# Altium project openmv-ae3-r3.PrjPcb (part 1 of 2)
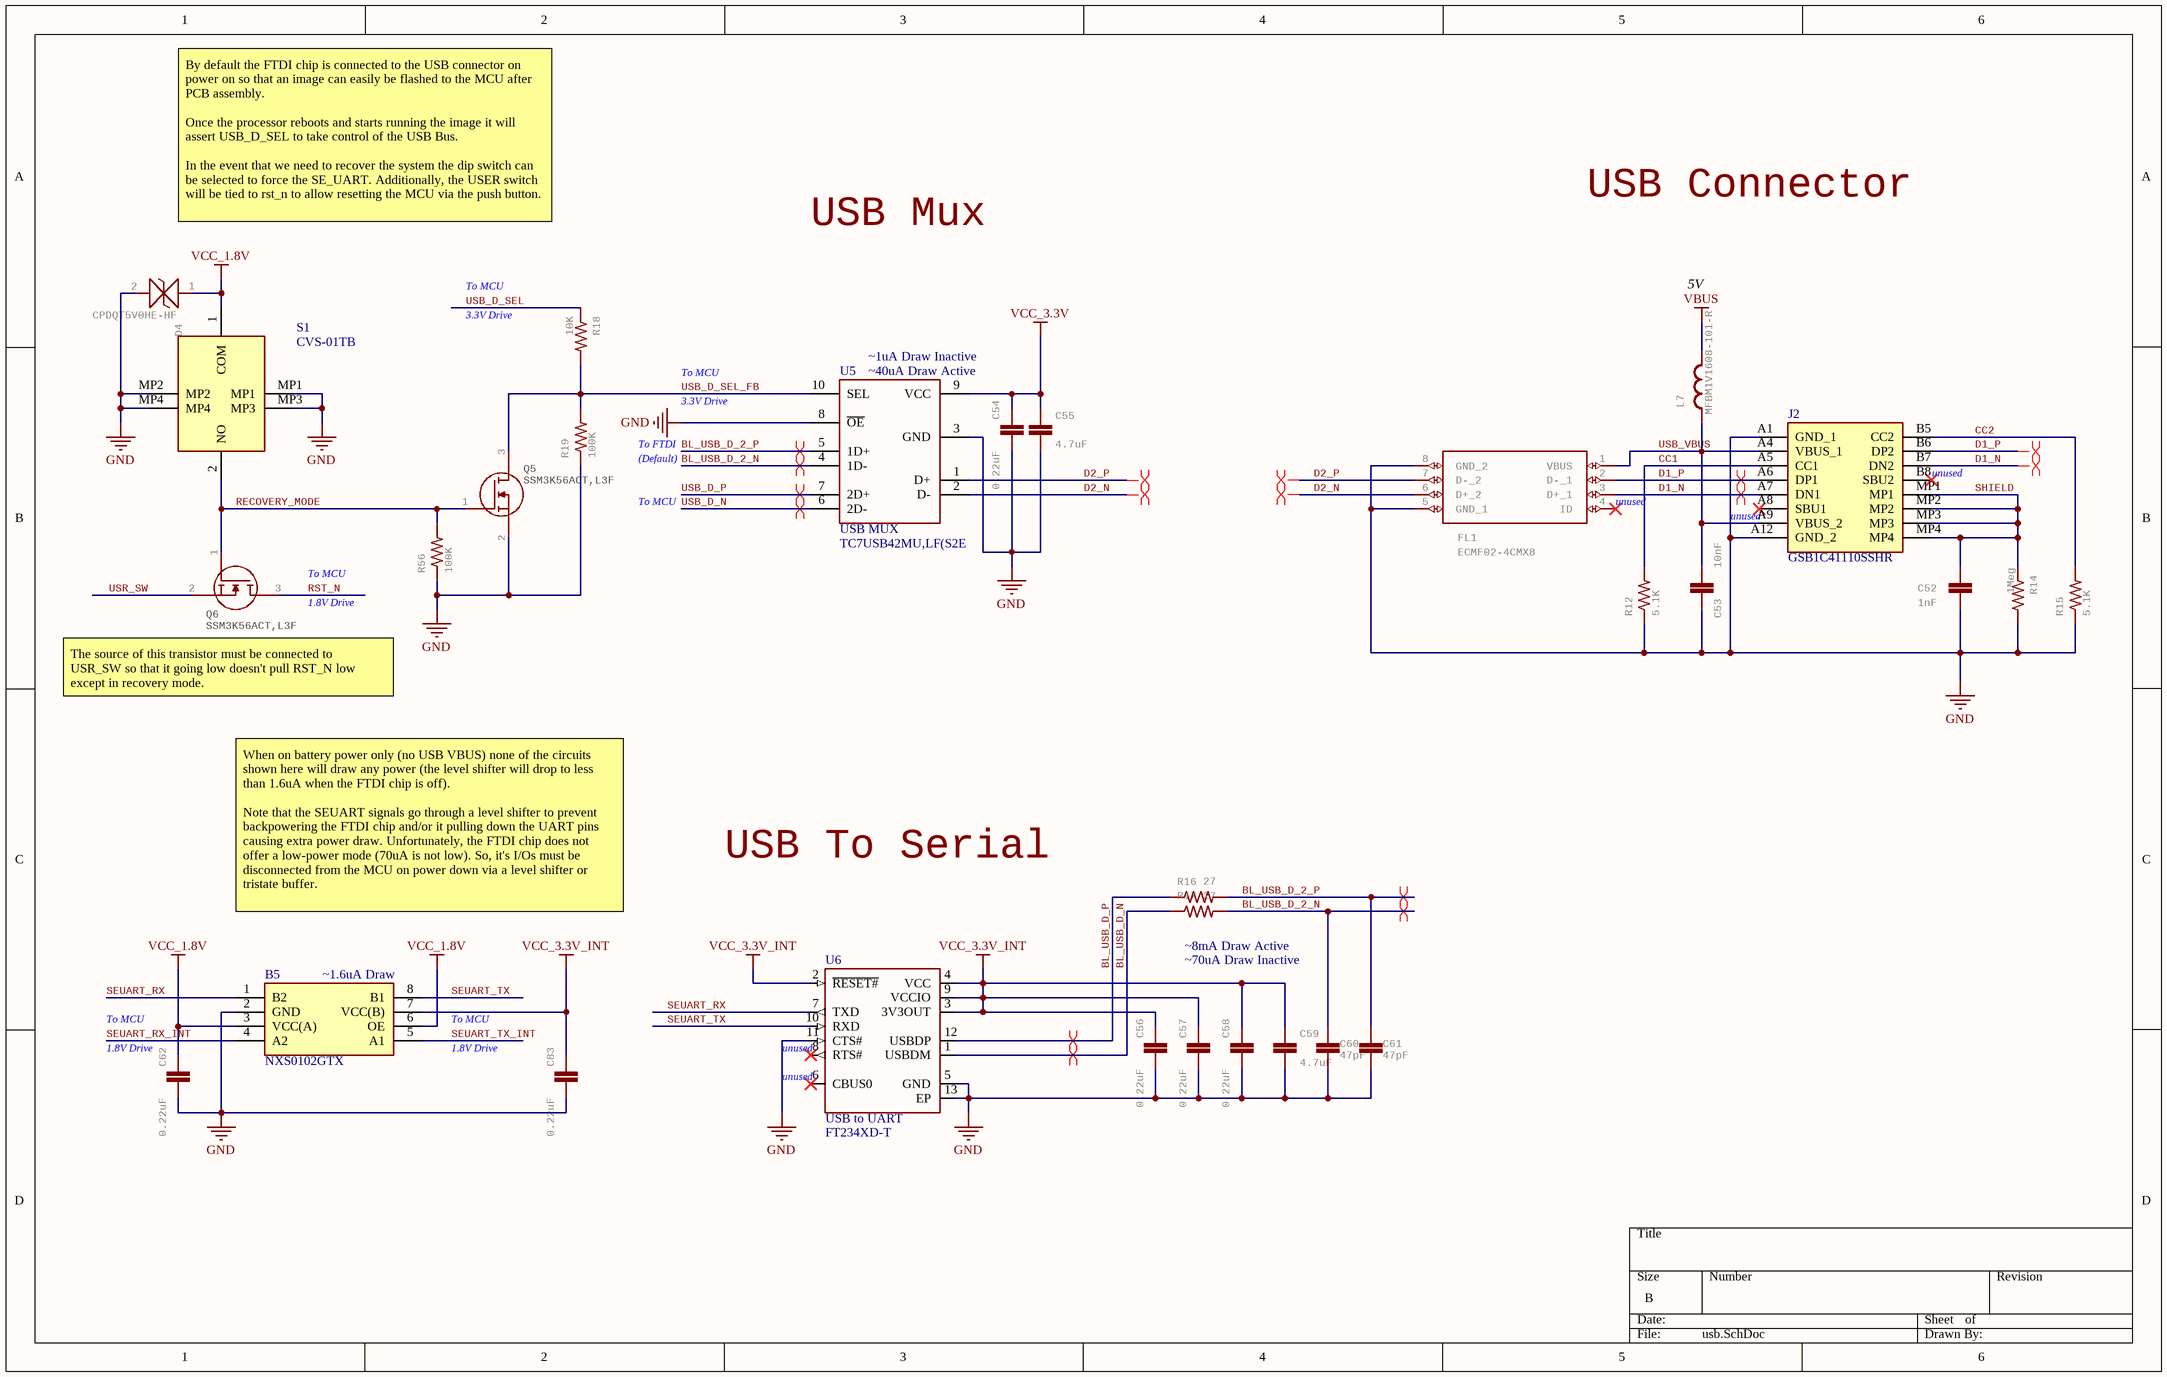
[diagram p0: usb.SchDoc]
10 sheets, 246 parts. Net scope: global (net labels, ports and power ports of the same name join across sheets).
Board file: openmv-ae3.PcbDoc
Sheets:
  usb.SchDoc
  wifi-bt.SchDoc
  flash.SchDoc
  imu.SchDoc
  camera.SchDoc
  tof.SchDoc
  mic.SchDoc
  regulators.SchDoc
  b2b.SchDoc
  processor.SchDoc

## Sheet usb.SchDoc
size B

### Parts
B5  NXS0102GTX  [NXS0102GTX]
C52  1nF  [0402-CAP]
C53  10nF  [0402-CAP]
C54  0.22uF  [C0201]
C55  4.7uF  [0402-CAP]
C56  0.22uF  [C0201]
C57  0.22uF  [C0201]
C58  0.22uF  [C0201]
C59  4.7uF  [0402-CAP]
C60  47pF  [C0201]
C61  47pF  [C0201]
C62  0.22uF  [C0201]
C83  0.22uF  [C0201]
D4  CPDQT5V0HE-HF  [CPDQT5V0HEHF]
FL1  ECMF02-4CMX8  [ECMF024CMX8]
J2  GSB1C41110SSHR  [GSB1C41110SSHR]
L7  MFBM1V1608-101-R  [0603-RES]
Q5  MPN: SSM3K56ACT,L3F  [DFN1006]  (hidden comment: NMOS)
Q6  MPN: SSM3K56ACT,L3F  [DFN1006]  (hidden comment: NMOS)
R12  5.1K  [R0201]
R14  1Meg  [0402-RES]
R15  5.1K  [R0201]
R16  27  [R0201]
R17  27  [R0201]
R18  10K  [R0201]
R19  100K  [R0201]
R56  100K  [R0201]
S1  CVS-01TB  [CVS01TB]
U5  USB MUX  [TC7USB42MU,LF(S2E]
U6  USB to UART  [SON45P300X300X80-13N]

### Nets
GND: B5.2(GND) C52.2 C53.1 C54.2 C55.1 C56.2 C57.2 C58.2 C59.1 C60.1 C61.1 C62.2 C83.2 D4.2 FL1.5(GND_1) FL1.8(GND_2) J2.A1(GND_1) J2.A12(GND_2) Q5.2(S) R12.1 R14.2 R15.1 R19.1 R56.1 S1.MP1 S1.MP2 S1.MP3 S1.MP4 U5.3(GND) U5.8(~{OE}) U6.5(GND) U6.11(CTS#) U6.13(EP)
VBUS: L7.2
VCC_1.8V: B5.3(VCC(A)) B5.6(OE) C62.1 D4.1 S1.1(COM)
VCC_3.3V: C54.1 C55.2 U5.9(VCC)
VCC_3.3V_INT: B5.7(VCC(B)) C56.1 C57.1 C58.1 C59.2 C83.1 U6.2(~{RESET#}) U6.3(3V3OUT) U6.4(VCC) U6.9(VCCIO)
BL_USB_D_2_N: C60.2 R17.2 U5.4(1D-)
BL_USB_D_2_P: C61.2 R16.2 U5.5(1D+)
BL_USB_D_N: R17.1 U6.1(USBDM)
BL_USB_D_P: R16.1 U6.12(USBDP)
CC1: J2.A5(CC1) R12.2
CC2: J2.B5(CC2) R15.2
D1_N: FL1.3(D+_1) J2.A7(DN1) J2.B7(DN2)
D1_P: FL1.2(D-_1) J2.A6(DP1) J2.B6(DP2)
D2_N: FL1.6(D+_2) U5.2(D-)
D2_P: FL1.7(D-_2) U5.1(D+)
RECOVERY_MODE: Q5.1(G) Q6.1(G) R56.2 S1.2(NO)
RST_N: Q6.3(D)
SEUART_RX: B5.1(B2) U6.7(TXD)
SEUART_RX_INT: B5.4(A2)
SEUART_TX: B5.8(B1) U6.10(RXD)
SEUART_TX_INT: B5.5(A1)
SHIELD: C52.1 J2.MP1 J2.MP2 J2.MP3 J2.MP4 R14.1
USB_D_N: U5.6(2D-)
USB_D_P: U5.7(2D+)
USB_D_SEL: R18.1
USB_D_SEL_FB: Q5.3(D) R18.2 R19.2 U5.10(SEL)
USB_VBUS: C53.2 FL1.1(VBUS) J2.A4(VBUS_1) J2.A9(VBUS_2) L7.1
USR_SW: Q6.2(S)

Not connected (* = marked no-connect by the designer): FL1 4(ID)*; J2 A8(SBU1)* B8(SBU2)*; U6 6(CBUS0)* 8(RTS#)*

### Layout directives
differential pair: BL_USB_D_2_N, BL_USB_D_2_P, BL_USB_D_N, BL_USB_D_P, D1_N, D1_P, D2_N, D2_P, USB_D_N, USB_D_P

### Notes on the sheet
- By default the FTDI chip is connected to the USB connector on power on so that an image can easily be flashed to the MCU after PCB assembly.
  Once the processor reboots and starts running the image it will assert USB_D_SEL to take control of the USB Bus.
  In the event that we need to recover the system the dip switch can be selected to force the SE_UART. Additionally, the USER switch will be tied to rst_n to allow resetting the MCU via the push button.
- USB Mux
- USB Connector
- To MCU
- 3.3V Drive
- 5V
- (near U5) ~1uA Draw Inactive
- (near U5) ~40uA Draw Active
- To FTDI
- (Default)
- (near FL1) unused
- (near J2) unused
- (near Q6) To MCU
- (near Q6) 1.8V Drive
- (near Q6) The source of this transistor must be connected to USR_SW so that it going low doesn't pull RST_N low except in recovery mode.
- USB To Serial
- When on battery power only (no USB VBUS) none of the circuits shown here will draw any power (the level shifter will drop to less than 1.6uA when the FTDI chip is off).
  Note that the SEUART signals go through a level shifter to prevent backpowering the FTDI chip and/or it pulling down the UART pins causing extra power draw. Unfortunately, the FTDI chip does not offer a low-power mode (70uA is not low). So, it's I/Os must be disconnected from the MCU on power down via a level shifter or tristate buffer.
- ~70uA Draw Inactive
- ~8mA Draw Active
- (near B5) ~1.6uA Draw
- (near C62) 1.8V Drive
- 1.8V Drive
- (near U6) unused

### Library data of the parts
B5 = NXS0102GTX: Dual supply translating transceiver; open drain; auto direction sensing; Manufacturer_Name: Nexperia; Geometry.Height: 0.5mm; Mouser Part Number: 771-NXS0102GTX; Mouser Price/Stock: https://www.mouser.co.uk/ProductDetail/Nexperia/NXS0102GTX?qs=GBLSl2AkirukzzJX55VgJA%3D%3D; Manufacturer_Part_Number: NXS0102GTX; Datasheet Link: https://assets.nexperia.com/documents/data-sheet/NXS0102.pdf; MPN: NXS0102GTX; Part Number: NXS0102GTX
C52 = CAP0402-CAP: Capacitor; MPN: VJ0402Y102JXACW1BC; GateName_1: G$1; SymbolName_1: CAP; DeviceName: 0402-CAP; LibraryName: sfe; DeviceSetName: CAP; Part Number: VJ0402Y102JXACW1BC
C53 = C-EUC0201: CAPACITOR, European symbol; MPN: 0402B103K250CT; GateName_1: G$1; SymbolName_1: C-EU; POPULARITY: 0; LibraryName: rcl; DeviceSetName: C-EU; SPICEPREFIX: C; Part Number: 0402B103K250CT
C54 C56-C58 C62 C83 = C-EUC0201: CAPACITOR, European symbol; MPN: GRM033R60J224ME15D; GateName_1: G$1; SymbolName_1: C-EU; POPULARITY: 0; DeviceName: C0201; LibraryName: rcl; DeviceSetName: C-EU; SPICEPREFIX: C; Part Number: GRM033R60J224ME15D
C55 C59 = CAP0402-CAP: CapacitorStandard 0603 ceramic capacitor, and 0.1" leaded capacitor.; MPN: JMK105BBJ475MV-F; GateName_1: G$1; SymbolName_1: CAP; DeviceName: 0402-CAP; LibraryName: sfe; DeviceSetName: CAP; Part Number: JMK105BBJ475MV-F
C60 C61 = C-EUC0201: CAPACITOR, European symbol; MPN: GRM0335C1H470GA01J; GateName_1: G$1; SymbolName_1: C-EU; POPULARITY: 0; DeviceName: C0201; SPICEPREFIX: C; Part Number: GRM0335C1H470GA01J
D4 = CPDQT5V0HE-HF: ESD Suppressors / TVS Diodes DIODE ESD 5VWM 65W 0402/SOD-923F   Source:  Datasheet; MANUFACTURER_NAME: Comchip Technology; GateName_1: G$1; SymbolName_1: CPDQT5V0HE-HF; LibraryName: CPDQT5V0HE-HF; DeviceSetName: CPDQT5V0HE-HF; HEIGHT: 0.42mm; MANUFACTURER_PART_NUMBER: CPDQT5V0HE-HF; MOUSER_PART_NUMBER: MOUSER_PART_NUMBER; MOUSER_PRICE-STOCK: MOUSER_PRICE-STOCK; MPN: CPDQT5V0HE-HF; Part Number: CPDQT5V0HE-HF
FL1 = ECMF02-4CMX8: Common Mode Filter & ESD Prot. USB uQFN8 STMicroelectronics ECMF02 Series, Signal Filter uQFN SMD, Flat Contact Termination, 2.6 x 1.3 x 0.6mm   Source:  Datasheet; GateName_1: G$1; SymbolName_1: ECMF02-4CMX8; LibraryName: ECMF02-4CMX8; DeviceSetName: ECMF02-4CMX8; HEIGHT: mm; MANUFACTURER_NAME: STMicroelectronics; MANUFACTURER_PART_NUMBER: ECMF02-4CMX8; MOUSER_PART_NUMBER: 511-ECMF02-4CMX8; MOUSER_PRICE-STOCK: https://www.mouser.co.uk/ProductDetail/STMicroelectronics/ECMF02-4CMX8?qs=xYt8xtm2zhmK7GoDlDZR3A%3D%3D; MPN: ECMF02-4CMX8; Part Number: ECMF02-4CMX8
J2 = GSB1C41110SSHR: Connector; Manufacturer_Name: Amphenol Communications Solutions; Datasheet Link: https://cdn.amphenol-cs.com/media/wysiwyg/files/drawing/gsb1c41x10sshr-ax1.pdf; Height: 3.41mm; Manufacturer_Part_Number: GSB1C41110SSHR; Part Number: GSB1C41110SSHR; MPN: GSB1C41110SSHR
L7 = INDUCTOR: InductorsBasic Inductor/Choke - 0603 and 1206. Footprints are not proven and vary greatly between part numbers.; GateName_1: G$1; MPN: MFBM1V1608-101-R; Part Number: MFBM1V1608-101-R
R12 R15 = RESISTOR0402-RES: ResistorBasic schematic elements and footprints for 0603, 1206, and PTH resistors.; MPN: AC0201FR-075K1L; GateName_1: G$1; SymbolName_1: RESISTOR; LibraryName: sfe; DeviceSetName: RESISTOR; Part Number: AC0201FR-075K1L
R14 = RESISTOR0402-RES: Resistor; MPN: CRCW04021M00FKEDC; GateName_1: G$1; SymbolName_1: RESISTOR; DeviceName: 0402-RES; LibraryName: sfe; DeviceSetName: RESISTOR; Part Number: CRCW04021M00FKEDC
R16 R17 = RESISTOR0402-RES: MPN: RC0201JR-0727RL; GateName_1: G$1; SymbolName_1: RESISTOR; LibraryName: sfe; DeviceSetName: RESISTOR; Part Number: RC0201JR-0727RL
R18 = RESISTOR0402-RES: MPN: RMCF0201FT10K0; GateName_1: G$1; SymbolName_1: RESISTOR; LibraryName: sfe; DeviceSetName: RESISTOR; Part Number: RMCF0201FT10K0
R19 R56 = RESISTOR0402-RES: MPN: RMCF0201FT100K; GateName_1: G$1; SymbolName_1: RESISTOR; LibraryName: sfe; DeviceSetName: RESISTOR; Part Number: RMCF0201FT100K
S1 = CVS-01TB: Switch; Manufacturer_Name: Nidec Copal; Datasheet Link: https://www.mouser.com/datasheet/2/972/cvs-1827291.pdf; Height: 1.45mm; Manufacturer_Part_Number: CVS-01TB; Mouser Part Number: 229-CVS-01TB; Mouser Price/Stock: https://www.mouser.co.uk/ProductDetail/Nidec-Components/CVS-01TB?qs=XeJtXLiO41SVso1ahlfkxQ%3D%3D; Arrow Part Number: CVS-01TB; Arrow Price/Stock: https://www.arrow.com/en/products/cvs-01tb/nidec-copal-electronics; Part Number: CVS-01TB; MPN: CVS-01TB
U5 = TC7USB42MU,LF(S2E: MF: Toshiba; MPN: TC7USB42MU,LF(S2E; Part Number: TC7USB42MU,LF(S2E
U6 = FT234XD-T: USB Bridge, USB to UART USB 2.0 UART Interface 12-DFN _3x3_; MF: FTDI,; Part Number: FT234XD-T; MPN: FT234XD-T
Q5 Q6 = NMOS: Part Number: SSM3K56ACT,L3F

## Sheet wifi-bt.SchDoc
size B
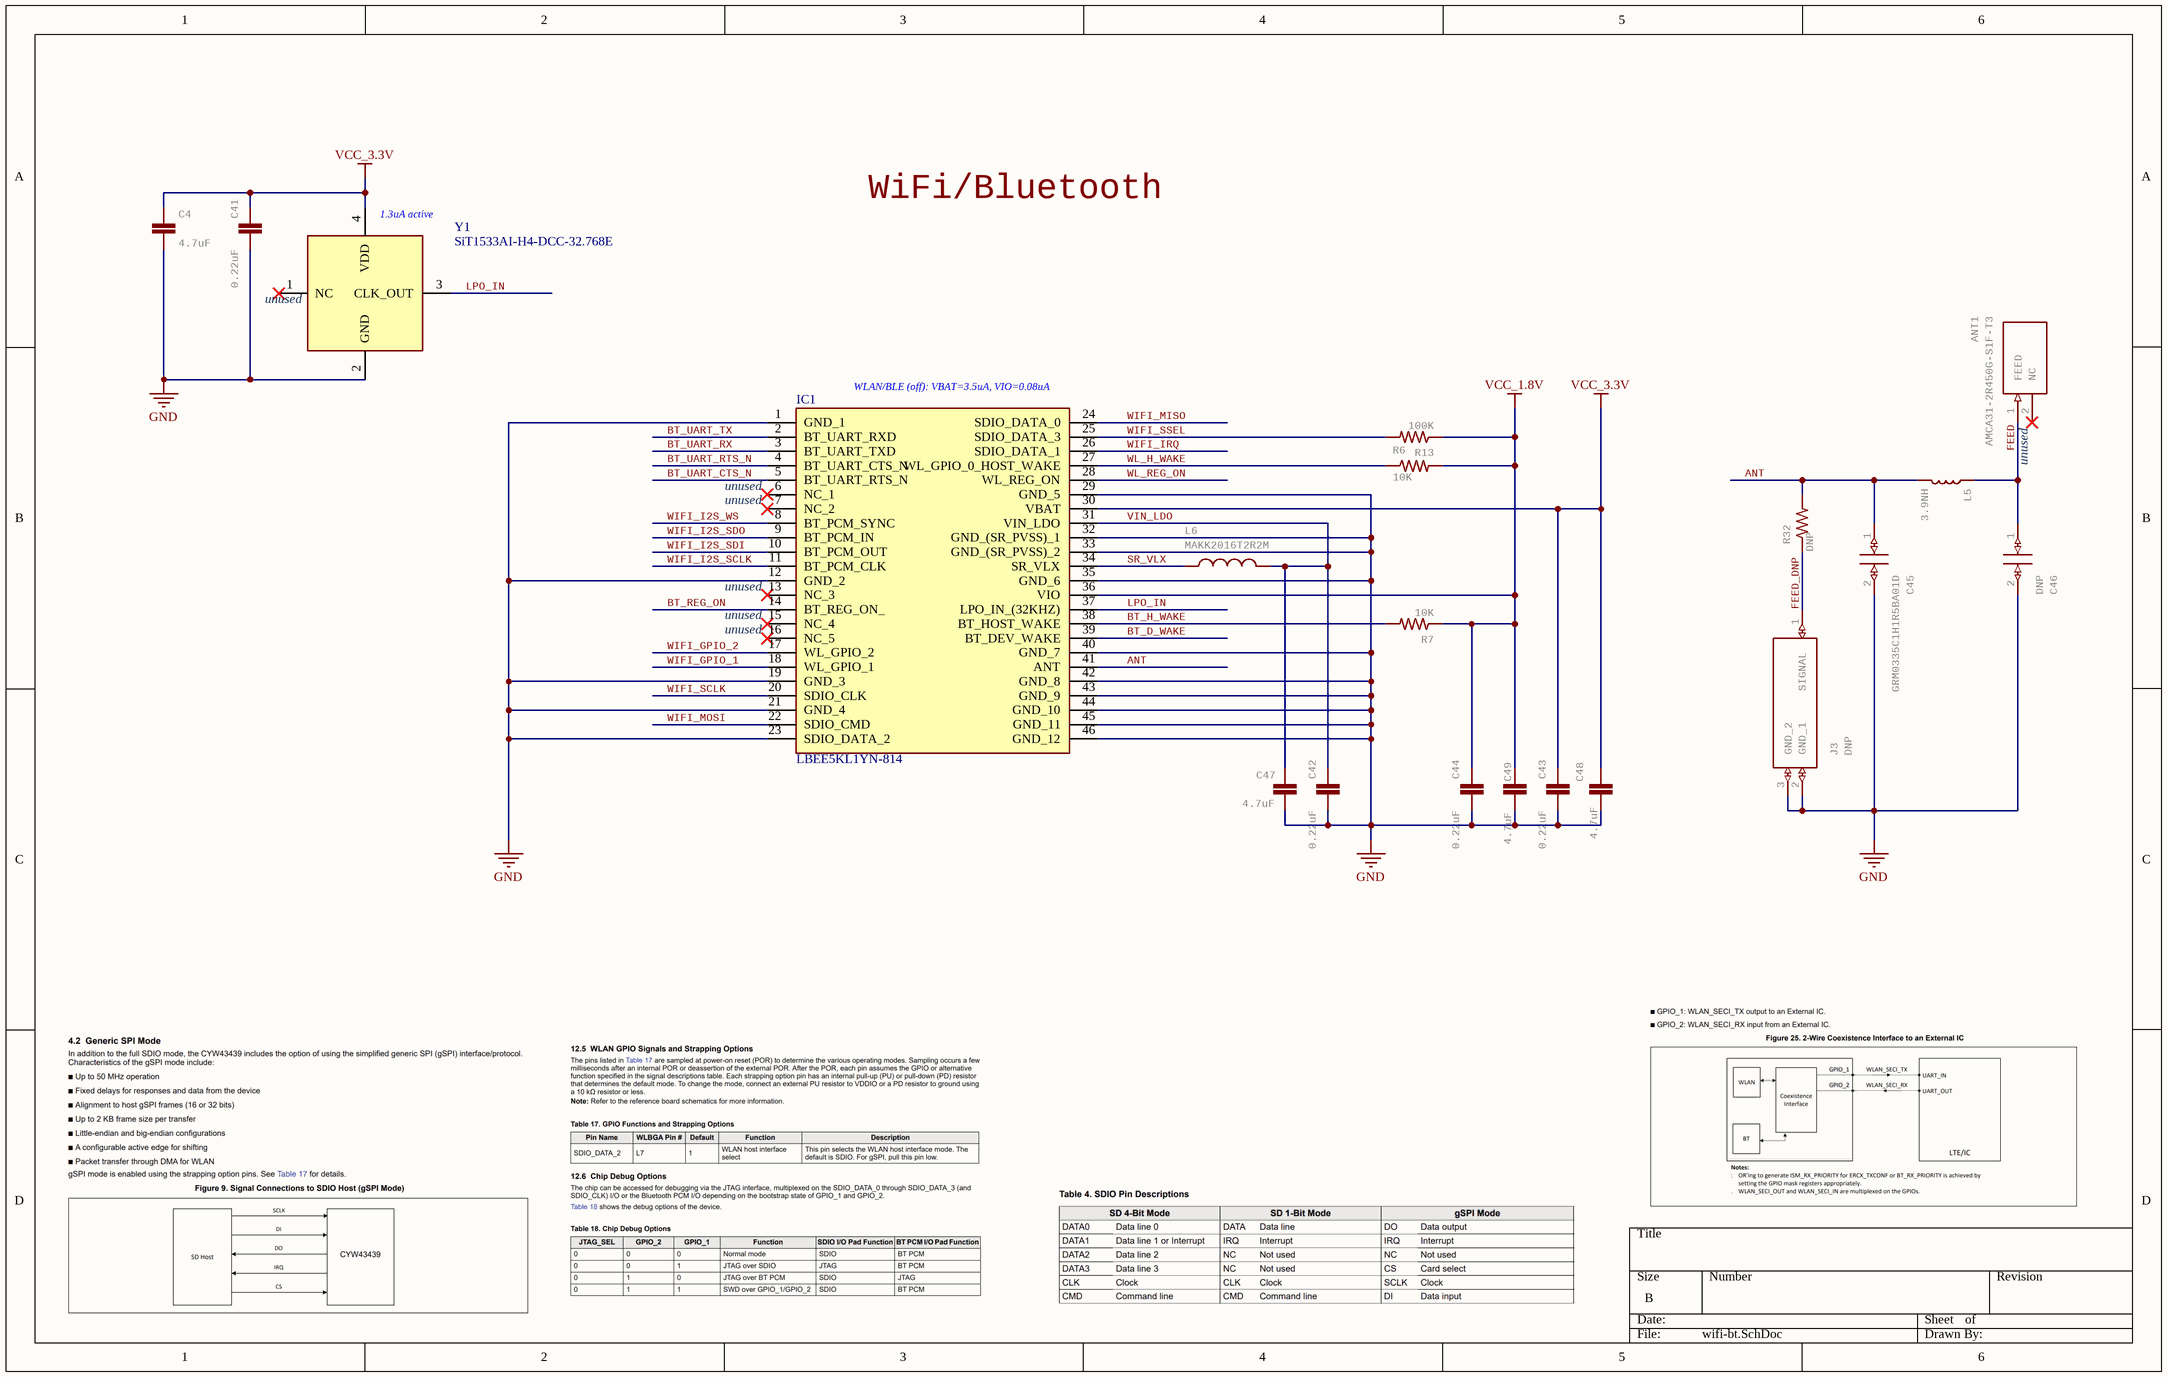
[diagram p1: wifi-bt.SchDoc]

### Parts
ANT1  AMCA31-2R450G-S1F-T3  [ANTC3216X140N]
C4  4.7uF  [0402-CAP]
C41  0.22uF  [C0201]
C42  0.22uF  [C0201]
C43  0.22uF  [C0201]
C44  0.22uF  [C0201]
C45  GRM0335C1H1R5BA01D  [CAPC0603X33N]
C46  DNP  [C0201-NO-3D]
C47  4.7uF  [0402-CAP]
C48  4.7uF  [0402-CAP]
C49  4.7uF  [0402-CAP]
IC1  LBEE5KL1YN-814  [LBEE5KL1YN814]
J3  DNP  [23370191-NO-3D]
L5  3.9NH  [0402]
L6  MAKK2016T2R2M  [INDC2016X100N]
R6  10K  [R0201]
R7  10K  [R0201]
R13  100K  [R0201]
R32  DNP  [0402-RES]
Y1  SiT1533AI-H4-DCC-32.768E  [SIT1533AIH4AA332768E]

### Nets
GND: C4.1 C41.2 C42.2 C43.2 C44.2 C45.2 C46.2 C47.1 C48.1 C49.1 IC1.1(GND_1) IC1.12(GND_2) IC1.19(GND_3) IC1.21(GND_4) IC1.23(SDIO_DATA_2) IC1.29(GND_5) IC1.32(GND_(SR_PVSS)_1) IC1.33(GND_(SR_PVSS)_2) IC1.35(GND_6) IC1.40(GND_7) IC1.42(GND_8) IC1.43(GND_9) IC1.44(GND_10) IC1.45(GND_11) IC1.46(GND_12) J3.2(GND_1) J3.3(GND_2) Y1.2(GND)
VCC_1.8V: C44.1 C49.2 IC1.36(VIO) R6.2 R7.1 R13.1
VCC_3.3V: C4.2 C41.1 C43.1 C48.2 IC1.30(VBAT) Y1.4(VDD)
ANT: C45.1 IC1.41(ANT) L5.2 R32.2
BT_D_WAKE: IC1.39(BT_DEV_WAKE)
BT_H_WAKE: IC1.38(BT_HOST_WAKE) R7.2
BT_REG_ON: IC1.14(BT_REG_ON_)
BT_UART_CTS_N: IC1.5(BT_UART_RTS_N)
BT_UART_RTS_N: IC1.4(BT_UART_CTS_N)
BT_UART_RX: IC1.3(BT_UART_TXD)
BT_UART_TX: IC1.2(BT_UART_RXD)
FEED: ANT1.1(FEED) C46.1 L5.1
FEED_DNP: J3.1(SIGNAL) R32.1
LPO_IN: IC1.37(LPO_IN_(32KHZ)) Y1.3(CLK_OUT)
SR_VLX: IC1.34(SR_VLX) L6.1
VIN_LDO: C42.1 C47.2 IC1.31(VIN_LDO) L6.2
WIFI_GPIO_1: IC1.18(WL_GPIO_1)
WIFI_GPIO_2: IC1.17(WL_GPIO_2)
WIFI_I2S_SCLK: IC1.11(BT_PCM_CLK)
WIFI_I2S_SDI: IC1.10(BT_PCM_OUT)
WIFI_I2S_SDO: IC1.9(BT_PCM_IN)
WIFI_I2S_WS: IC1.8(BT_PCM_SYNC)
WIFI_IRQ: IC1.26(SDIO_DATA_1)
WIFI_MISO: IC1.24(SDIO_DATA_0)
WIFI_MOSI: IC1.22(SDIO_CMD)
WIFI_SCLK: IC1.20(SDIO_CLK)
WIFI_SSEL: IC1.25(SDIO_DATA_3) R13.2
WL_H_WAKE: IC1.27(WL_GPIO_0_HOST_WAKE) R6.1
WL_REG_ON: IC1.28(WL_REG_ON)

Not connected (* = marked no-connect by the designer): ANT1 2(NC)*; IC1 6(NC_1)* 7(NC_2)* 13(NC_3)* 15(NC_4)* 16(NC_5)*; Y1 1(NC)*

### Notes on the sheet
- (near Y1) 1.3uA active
- WiFi/Bluetooth
- (near Y1) unused
- (near IC1) WLAN/BLE (off): VBAT=3.5uA, VIO=0.08uA
- (near ANT1) unused
- (near IC1) unused

### Library data of the parts
ANT1 = AMCA31-2R450G-S1F-T3: ABRACON - AMCA31-2R450G-S1F-T3 - ANTENNA, CHIP, 2.45GHZ, 50 OHM, 1206   Source:  Datasheet; GateName_1: G$1; SymbolName_1: AMCA31-2R450G-S1F-T3; LibraryName: AMCA31-2R450G-S1F-T3; DeviceSetName: AMCA31-2R450G-S1F-T3; HEIGHT: 1.4mm; MANUFACTURER_NAME: ABRACON; MANUFACTURER_PART_NUMBER: AMCA31-2R450G-S1F-T3; MOUSER_PART_NUMBER: 815-CA312R450GS1FT3; MOUSER_PRICE-STOCK: https://www.mouser.co.uk/ProductDetail/ABRACON/AMCA31-2R450G-S1F-T3?qs=AAveGqk956GLuOddQEK40Q%3D%3D; MPN: AMCA31-2R450G-S1F-T3; Part Number: AMCA31-2R450G-S1F-T3
C4 C47-C49 = CAP0402-CAP: as C55 on sheet usb; DeviceName: 0402-CAP; LibraryName: sfe; DeviceSetName: CAP; Part Number: JMK105BBJ475MV-F
C41-C44 = C-EUC0201: as C54 on sheet usb; DeviceName: C0201; LibraryName: rcl; DeviceSetName: C-EU; SPICEPREFIX: C; Part Number: GRM033R60J224ME15D
C45 = GRM0335C1H1R5BA01D: Chip Capacitor value 1R5   Source:  Datasheet; MANUFACTURER_NAME: Murata Electronics; GateName_1: G$1; SymbolName_1: GRM0335C1H1R5BA01D; LibraryName: GRM0335C1H1R5BA01D; DeviceSetName: GRM0335C1H1R5BA01D; HEIGHT: 0.33mm; MANUFACTURER_PART_NUMBER: GRM0335C1H1R5BA01D; MOUSER_PART_NUMBER: 81-GRM0335C1H1R5BA1D; MOUSER_PRICE-STOCK: https://www.mouser.co.uk/ProductDetail/Murata-Electronics/GRM0335C1H1R5BA01D?qs=7vGxPDjevFPFqveGwv%252BPUQ%3D%3D; MPN: GRM0335C1H1R5BA01D; Part Number: GRM0335C1H1R5BA01D
C46 = GRM0335C1H1R5BA01D: Chip Capacitor value 1R5   Source:  Datasheet; MANUFACTURER_NAME: Murata Electronics; GateName_1: G$1; POPULATE: 0; SymbolName_1: GRM0335C1H1R5BA01D; LibraryName: GRM0335C1H1R5BA01D; DeviceSetName: GRM0335C1H1R5BA01D; HEIGHT: 0.33mm; MANUFACTURER_PART_NUMBER: GRM0335C1H1R5BA01D; MOUSER_PART_NUMBER: 81-GRM0335C1H1R5BA1D; MOUSER_PRICE-STOCK: https://www.mouser.co.uk/ProductDetail/Murata-Electronics/GRM0335C1H1R5BA01D?qs=7vGxPDjevFPFqveGwv%252BPUQ%3D%3D; MPN: DNP; Part Number: DNP
IC1 = LBEE5KL1YN-814: Integrated Circuit; Manufacturer_Name: Murata Electronics; Datasheet Link: https://www.murata.com/products/productdata/8815814344734/type1yn.pdf; Height: 1.1mm; Manufacturer_Part_Number: LBEE5KL1YN-814; Mouser Part Number: 81-LBEE5KL1YN-814; Mouser Price/Stock: https://www.mouser.co.uk/ProductDetail/Murata-Electronics/LBEE5KL1YN-814?qs=TCDPyi3sCW1FrH0sh%252Bb5wA%3D%3D; Arrow Part Number: LBEE5KL1YN-814; Arrow Price/Stock: https://www.arrow.com/en/products/lbee5kl1yn-814/murata-manufacturing?region=nac; Part Number: LBEE5KL1YN-814; MPN: LBEE5KL1YN-814
J3 = 2337019-1: RF Connectors / Coaxial Connectors MicroCoax receptacle UMCC Gen 1   Source:  Datasheet; MANUFACTURER_NAME: TE Connectivity; GateName_1: G$1; POPULATE: 0; SymbolName_1: 2337019-1; LibraryName: 2337019-1; DeviceSetName: 2337019-1; HEIGHT: 1.4mm; MANUFACTURER_PART_NUMBER: 2337019-1; MOUSER_PART_NUMBER: 571-2337019-1; MOUSER_PRICE-STOCK: https://www.mouser.co.uk/ProductDetail/TE-Connectivity/2337019-1?qs=l4Gc20tDgJIuN7nS9rJkJw%3D%3D; MPN: DNP; Part Number: DNP
L5 = INDUCTOR-0402-3.9NH: Inductors    Resist changes in electrical current. Basically a coil of wire.   SparkFun Products:  SparkFun Load Cell Amplifier - HX711  IOIO-OTG - V2.2; MPN: L-07C3N9SV6T; GateName_1: G$1; PROD_ID: NDUC-13457; SymbolName_1: INDUCTOR; DeviceName: -0402-3.9NH; LibraryName: SparkFun-Coils; DeviceSetName: INDUCTOR; Part Number: L-07C3N9SV6T
L6 = MAKK2016T2R2M: INDUCTOR, METAL CORE Check availability; GateName_1: G$1; MF: Taiyo Yuden; SymbolName_1: MAKK2016T2R2M; LibraryName: MAKK2016T2R2M; DeviceSetName: MAKK2016T2R2M; AVAILABILITY: In Stock; MP: MAKK2016T2R2M; MPN: MAKK2016T2R2M; PACKAGE: 2016 Taiyo Yuden; PRICE: None; PURCHASE-URL: https://pricing.snapeda.com/search/part/MAKK2016T2R2M/?ref=eda; Part Number: MAKK2016T2R2M
R6 R7 = RESISTOR0402-RES: MPN: RMCF0201FT10K0; GateName_1: G$1; SymbolName_1: RESISTOR; LibraryName: sfe; DeviceSetName: RESISTOR; Part Number: RMCF0201FT10K0
R13 = RESISTOR0402-RES: MPN: RMCF0201FT100K; GateName_1: G$1; SymbolName_1: RESISTOR; LibraryName: sfe; DeviceSetName: RESISTOR; Part Number: RMCF0201FT100K
R32 = RESISTOR0402-RES: Resistor; GateName_1: G$1; SymbolName_1: RESISTOR; DeviceName: 0402-RES; LibraryName: sfe; DeviceSetName: RESISTOR; MPN: DNP; Part Number: DNP
Y1 = SIT1533AI-H4-AA3-32.768E: Crystal or Oscillator; Manufacturer_Name: SiTime; Datasheet Link: https://www.mouser.com/datasheet/2/371/SiT1533_datasheet-1324419.pdf; Height: 0.6mm; Manufacturer_Part_Number: SiT1533AI-H4-DCC-32.768E; Mouser Part Number: 788-1533AIH4DCC32.76; Mouser Price/Stock: https://www.mouser.com/ProductDetail/SiTime/SiT1533AI-H4-DCC-32.768E?qs=5SDzjInHUKoUZz9ePr9JwA%3D%3D; Arrow Part Number: SiT1533AI-H4-DCC-32.768E; MPN: SiT1533AI-H4-DCC-32.768E; Part Number: SiT1533AI-H4-DCC-32.768E

## Sheet flash.SchDoc
size A
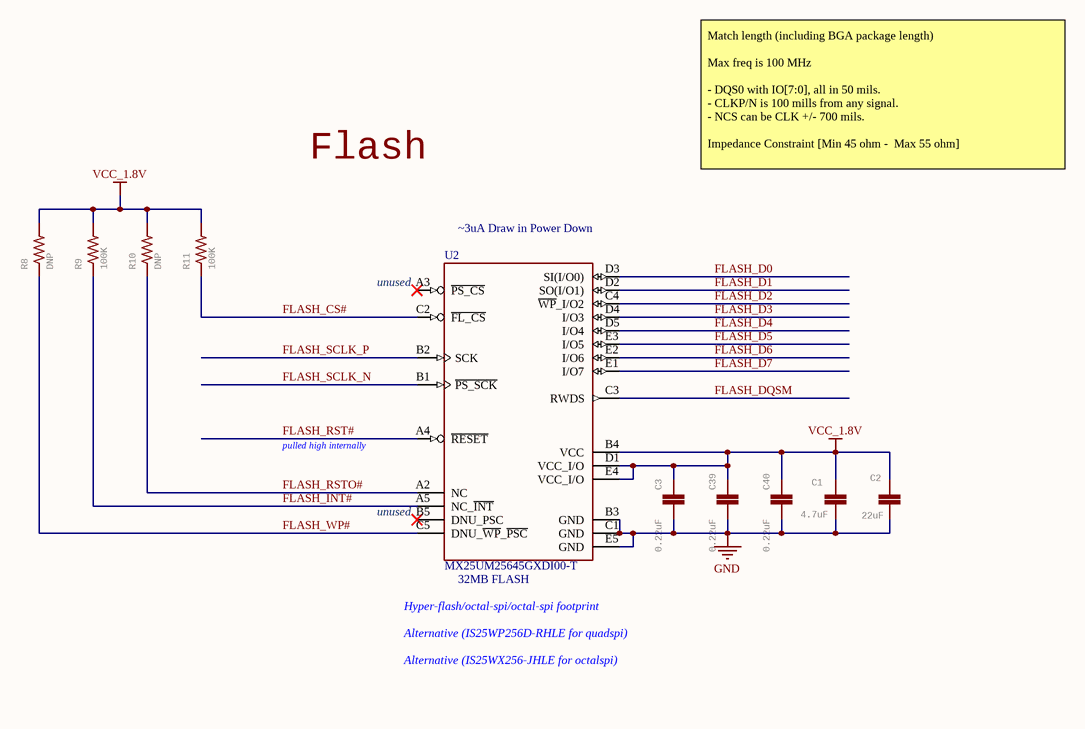
[diagram p2: flash.SchDoc]

### Parts
C1  4.7uF  [0402-CAP]
C2  22uF  [0805]
C3  0.22uF  [C0201]
C39  0.22uF  [C0201]
C40  0.22uF  [C0201]
R8  DNP  [R0201]
R9  100K  [R0201]
R10  DNP  [R0201]
R11  100K  [R0201]
U2  MX25UM25645GXDI00-T  [24-TBGA]

### Nets
GND: C1.1 C2.1 C3.2 C39.2 C40.2 U2.B3(GND) U2.C1(GND) U2.E5(GND)
VCC_1.8V: C1.2 C2.2 C3.1 C39.1 C40.1 R8.2 R9.2 R10.2 R11.2 U2.B4(VCC) U2.D1(VCC_I/O) U2.E4(VCC_I/O)
FLASH_CS#: R11.1 U2.C2(~{FL_CS})
FLASH_D0: U2.D3(SI(I/O0))
FLASH_D1: U2.D2(SO(I/O1))
FLASH_D2: U2.C4(~{WP}_I/O2)
FLASH_D3: U2.D4(I/O3)
FLASH_D4: U2.D5(I/O4)
FLASH_D5: U2.E3(I/O5)
FLASH_D6: U2.E2(I/O6)
FLASH_D7: U2.E1(I/O7)
FLASH_DQSM: U2.C3(RWDS)
FLASH_INT#: R9.1 U2.A5(NC_~{INT})
FLASH_RST#: U2.A4(~{RESET})
FLASH_RSTO#: R10.1 U2.A2(NC)
FLASH_SCLK_N: U2.B1(~{PS_SCK})
FLASH_SCLK_P: U2.B2(SCK)
FLASH_WP#: R8.1 U2.C5(DNU_~{WP}_~{PSC})

Not connected (* = marked no-connect by the designer): U2 A3(~{PS_CS})* B5(DNU_PSC)*

### Notes on the sheet
- Flash
- Match length (including BGA package length)
  Max freq is 100 MHz
  - DQS0 with IO[7:0], all in 50 mils.
  - CLKP/N is 100 mills from any signal.
  - NCS can be CLK +/- 700 mils.
  Impedance Constraint [Min 45 ohm -  Max 55 ohm]
- (near U2) ~3uA Draw in Power Down
- (near U2) unused
- pulled high internally
- Hyper-flash/octal-spi/octal-spi footprint
- (near U2) 32MB FLASH
- Alternative (IS25WP256D-RHLE for quadspi)
- Alternative (IS25WX256-JHLE for octalspi)

### Library data of the parts
C1 = CAP0402-CAP: as C55 on sheet usb; DeviceName: 0402-CAP; LibraryName: sfe; DeviceSetName: CAP; Part Number: JMK105BBJ475MV-F
C2 = 22UF-0805-6.3V-20%: 22ÂµF ceramic capacitors    A capacitor is a passive two-terminal electrical component used to store electrical energy temporarily in an electric field.; MPN: CL21A226MQQNNNE; GateName_1: G$1; SymbolName_1: CAP; PROD_ID: CAP-08402; DeviceName: -0805-6.3V-20%; LibraryName: SparkFun-Capacitors; DeviceSetName: 22UF; Part Number: CL21A226MQQNNNE
C3 C39 C40 = C-EUC0201: as C54 on sheet usb; DeviceName: C0201; LibraryName: rcl; DeviceSetName: C-EU; SPICEPREFIX: C; Part Number: GRM033R60J224ME15D
R8 R10 = RESISTOR0402-RES: GateName_1: G$1; SymbolName_1: RESISTOR; LibraryName: sfe; DeviceSetName: RESISTOR; MPN: DNP; Part Number: DNP
R9 R11 = RESISTOR0402-RES: MPN: RMCF0201FT100K; GateName_1: G$1; SymbolName_1: RESISTOR; LibraryName: sfe; DeviceSetName: RESISTOR; Part Number: RMCF0201FT100K
U2 = IS25WX256-JHLE: IC, Flash,32MB x 8, Octal SPI, Ind Temp, 1.8V,24-BGA; MF: ISSI; Part Number: MX25UM25645GXDI00-T; MPN: MX25UM25645GXDI00-T

## Sheet imu.SchDoc
size A
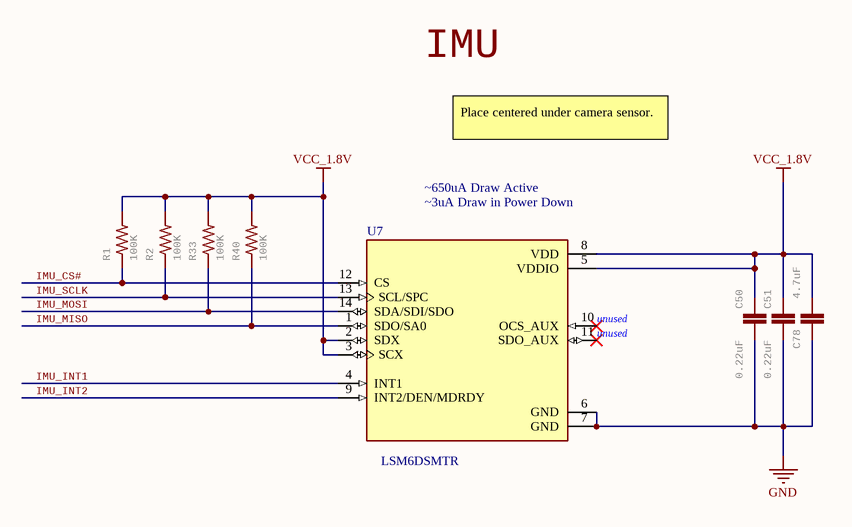
[diagram p3: imu.SchDoc]

### Parts
C50  0.22uF  [C0201]
C51  0.22uF  [C0201]
C78  4.7uF  [0402-CAP]
R1  100K  [R0201]
R2  100K  [R0201]
R33  100K  [R0201]
R40  100K  [R0201]
U7  (no value)  [LSM6DSMTR]

### Nets
GND: C50.2 C51.2 C78.1 U7.6(GND) U7.7(GND)
VCC_1.8V: C50.1 C51.1 C78.2 R1.2 R2.2 R33.2 R40.2 U7.2(SDX) U7.3(SCX) U7.5(VDDIO) U7.8(VDD)
IMU_CS#: R1.1 U7.12(CS)
IMU_INT1: U7.4(INT1)
IMU_INT2: U7.9(INT2/DEN/MDRDY)
IMU_MISO: R40.1 U7.1(SDO/SA0)
IMU_MOSI: R33.1 U7.14(SDA/SDI/SDO)
IMU_SCLK: R2.1 U7.13(SCL/SPC)

Not connected (* = marked no-connect by the designer): U7 10(OCS_AUX)* 11(SDO_AUX)*

### Notes on the sheet
- IMU
- ~650uA Draw Active
- Place centered under camera sensor.
- (near U7) ~3uA Draw in Power Down
- (near U7) unused

### Library data of the parts
C50 C51 = C-EUC0201: as C54 on sheet usb; DeviceName: C0201; LibraryName: rcl; DeviceSetName: C-EU; SPICEPREFIX: C; Part Number: GRM033R60J224ME15D
C78 = CAP_0402: 0402 (1005 Metric) Nick Garner - TeleSense; MPN: JMK105BBJ475MV-F; GateName_1: G$1; SymbolName_1: CAP; LibraryName: 0402; DeviceSetName: CAP_0402
R1 R2 R33 R40 = RESISTOR0402-RES: MPN: RMCF0201FT100K; GateName_1: G$1; SymbolName_1: RESISTOR; LibraryName: sfe; DeviceSetName: RESISTOR; Part Number: RMCF0201FT100K
U7 = LSM6DSMTR: Accelerometer, Gyroscope, Temperature, 6 Axis Sensor IÂ²C, SPI Output; MF: STMicroelectronics; Design Item ID: LSM6DSMTR; Package: VFLGA-14 STMicroelectronics; Component Type: Standard; Price: None; Value: *; Pin Count: 14; SnapEDA_Link: https://www.snapeda.com/parts/LSM6DSMTR/STMicroelectronics/view-part/581716/?ref=snap; Availability: Unavailable; Source: SnapEDAsch.SchLib; MP: LSM6DSMTR; MPN: LSM6DSMTR; Part Number: LSM6DSMTR

## Sheet camera.SchDoc
size A
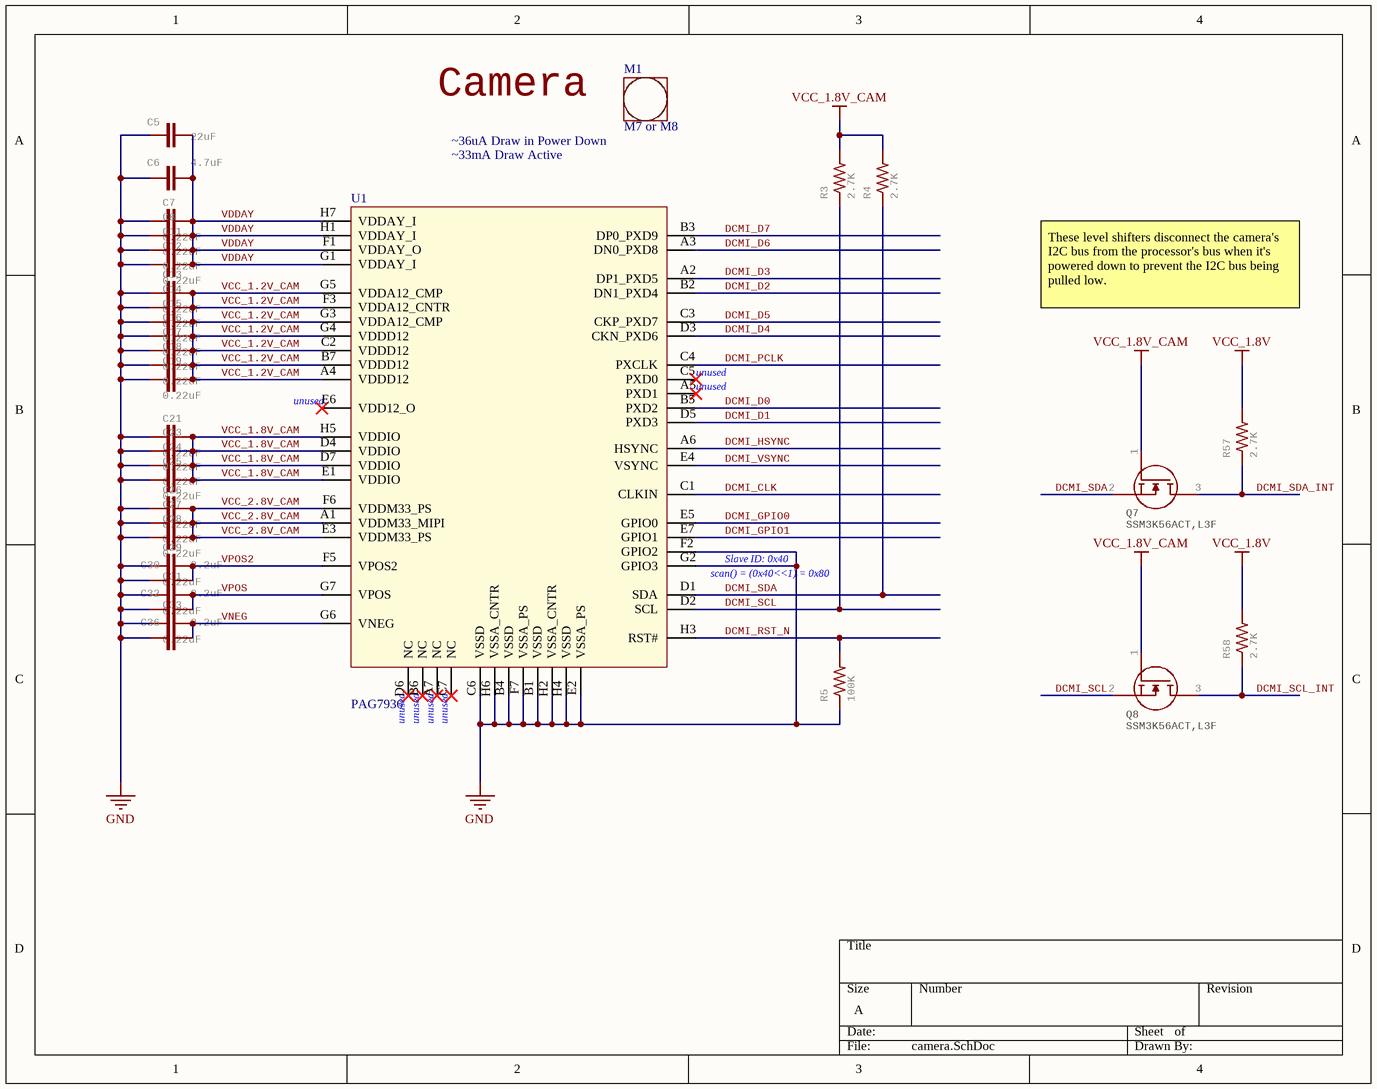
[diagram p4: camera.SchDoc]

### Parts
C5  22uF  [0805]
C6  4.7uF  [0402-CAP]
C7  0.22uF  [C0201]
C8  0.22uF  [C0201]
C11  0.22uF  [C0201]
C12  0.22uF  [C0201]
C13  0.22uF  [C0201]
C14  0.22uF  [C0201]
C15  0.22uF  [C0201]
C16  0.22uF  [C0201]
C17  0.22uF  [C0201]
C18  0.22uF  [C0201]
C19  0.22uF  [C0201]
C21  0.22uF  [C0201]
C23  0.22uF  [C0201]
C24  0.22uF  [C0201]
C25  0.22uF  [C0201]
C26  0.22uF  [C0201]
C27  0.22uF  [C0201]
C28  0.22uF  [C0201]
C29  0.22uF  [C0201]
C30  2.2uF  [0402-CAP]
C31  0.22uF  [C0201]
C32  2.2uF  [0402-CAP]
C33  0.22uF  [C0201]
C36  2.2uF  [0402-CAP]
M1  M7 or M8  [M7_M8]
Q7  MPN: SSM3K56ACT,L3F  [DFN1006]  (hidden comment: NMOS)
Q8  MPN: SSM3K56ACT,L3F  [DFN1006]  (hidden comment: NMOS)
R3  2.7K  [R0201]
R4  2.7K  [R0201]
R5  100K  [R0201]
R57  2.7K  [R0201]
R58  2.7K  [R0201]
U1  PAG7936  [PAG7936]

### Nets
GND: C5.1 C6.1 C7.1 C8.1 C11.1 C12.1 C13.1 C14.1 C15.1 C16.1 C17.1 C18.1 C19.1 C21.1 C23.1 C24.1 C25.1 C26.1 C27.1 C28.1 C29.1 C30.1 C31.1 C32.1 C33.1 C36.1 R5.1 U1.B1(VSSD) U1.B4(VSSD) U1.C6(VSSD) U1.E2(VSSA_PS) U1.F2(GPIO2) U1.F7(VSSA_PS) U1.G2(GPIO3) U1.H2(VSSA_CNTR) U1.H4(VSSD) U1.H6(VSSA_CNTR)
VCC_1.2V_CAM: C13.2 C14.2 C15.2 C16.2 C17.2 C18.2 C19.2 U1.A4(VDDD12) U1.B7(VDDD12) U1.C2(VDDD12) U1.F3(VDDA12_CNTR) U1.G3(VDDA12_CMP) U1.G4(VDDD12) U1.G5(VDDA12_CMP)
VCC_1.8V: R57.2 R58.2
VCC_1.8V_CAM: C21.2 C23.2 C24.2 C25.2 Q7.1(G) Q8.1(G) R3.2 R4.2 U1.D4(VDDIO) U1.D7(VDDIO) U1.E1(VDDIO) U1.H5(VDDIO)
VCC_2.8V_CAM: C26.2 C27.2 C28.2 U1.A1(VDDM33_MIPI) U1.E3(VDDM33_PS) U1.F6(VDDM33_PS)
DCMI_CLK: U1.C1(CLKIN)
DCMI_D0: U1.B5(PXD2)
DCMI_D1: U1.D5(PXD3)
DCMI_D2: U1.B2(DN1_PXD4)
DCMI_D3: U1.A2(DP1_PXD5)
DCMI_D4: U1.D3(CKN_PXD6)
DCMI_D5: U1.C3(CKP_PXD7)
DCMI_D6: U1.A3(DN0_PXD8)
DCMI_D7: U1.B3(DP0_PXD9)
DCMI_GPIO0: U1.E5(GPIO0)
DCMI_GPIO1: U1.E7(GPIO1)
DCMI_HSYNC: U1.A6(HSYNC)
DCMI_PCLK: U1.C4(PXCLK)
DCMI_RST_N: R5.2 U1.H3(RST#)
DCMI_SCL: Q8.2(S) R3.1 U1.D2(SCL)
DCMI_SCL_INT: Q8.3(D) R58.1
DCMI_SDA: Q7.2(S) R4.1 U1.D1(SDA)
DCMI_SDA_INT: Q7.3(D) R57.1
DCMI_VSYNC: U1.E4(VSYNC)
VDDAY: C5.2 C6.2 C7.2 C8.2 C11.2 C12.2 U1.F1(VDDAY_O) U1.G1(VDDAY_I) U1.H1(VDDAY_I) U1.H7(VDDAY_I)
VNEG: C33.2 C36.2 U1.G6(VNEG)
VPOS: C31.2 C32.2 U1.G7(VPOS)
VPOS2: C29.2 C30.2 U1.F5(VPOS2)

Not connected (* = marked no-connect by the designer): U1 A5(PXD1)* A7(NC)* B6(NC)* C5(PXD0)* C7(NC)* D6(NC)* E6(VDD12_O)*

### Notes on the sheet
- Camera
- (near M1) ~36uA Draw in Power Down
- ~33mA Draw Active
- These level shifters disconnect the camera's I2C bus from the processor's bus when it's powered down to prevent the I2C bus being pulled low.
- (near U1) unused
- (near U1) scan() = (0x40<<1) = 0x80
- Slave ID: 0x40

### Library data of the parts
C5 = 22UF-0805-6.3V-20%: as C2 on sheet flash; DeviceName: -0805-6.3V-20%; LibraryName: SparkFun-Capacitors; DeviceSetName: 22UF
C6 = CAP_0402: as C78 on sheet imu; LibraryName: 0402; DeviceSetName: CAP_0402
C7 C8 C11-C19 C21 C23-C29 C31 C33 = C-EUC0201: as C54 on sheet usb; DeviceName: C0201; LibraryName: rcl; DeviceSetName: C-EU; SPICEPREFIX: C; Part Number: GRM033R60J224ME15D
C30 C32 C36 = CAP_0402: 0402 (1005 Metric) Nick Garner - TeleSense; MPN: CL05A225MQ5NNNC; GateName_1: G$1; SymbolName_1: CAP; LibraryName: 0402; DeviceSetName: CAP_0402
M1 = M7_M8_LENS_MOUNT
R3 R4 R57 R58 = RESISTOR0402-RES: MPN: RC0201JR-072K7L; GateName_1: G$1; SymbolName_1: RESISTOR; LibraryName: sfe; DeviceSetName: RESISTOR; Part Number: RC0201JR-072K7L
R5 = RESISTOR0402-RES: MPN: RMCF0201FT100K; GateName_1: G$1; SymbolName_1: RESISTOR; LibraryName: sfe; DeviceSetName: RESISTOR; Part Number: RMCF0201FT100K
U1 = PAG7936: MF: PixArt; MPN: PAG7936
Q7 Q8 = NMOS: Part Number: SSM3K56ACT,L3F

## Sheet tof.SchDoc
size A
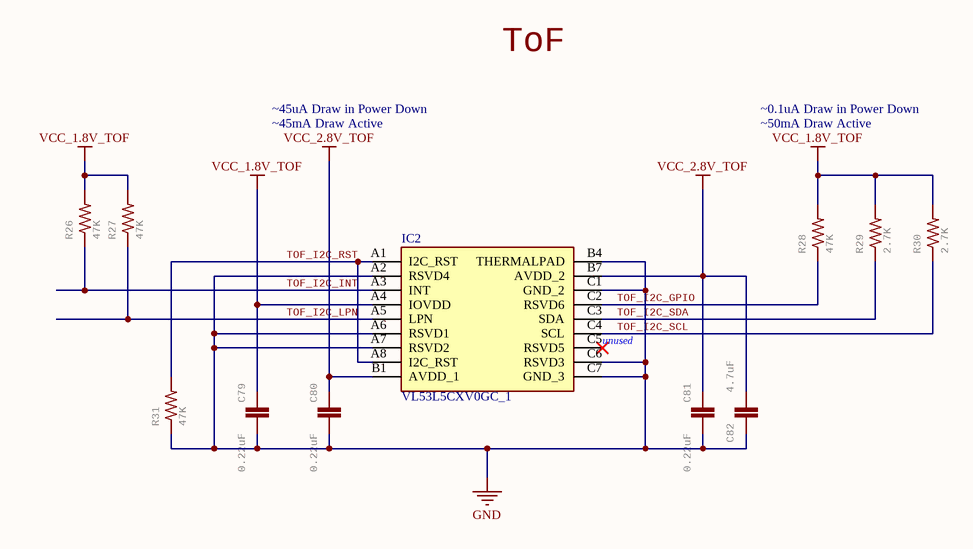
[diagram p5: tof.SchDoc]

### Parts
C79  0.22uF  [C0201]
C80  0.22uF  [C0201]
C81  0.22uF  [C0201]
C82  4.7uF  [0402-CAP]
IC2  VL53L5CXV0GC_1  [VL53L5CXV0GC1]
R26  47K  [R0201]
R27  47K  [R0201]
R28  47K  [R0201]
R29  2.7K  [R0201]
R30  2.7K  [R0201]
R31  47K  [R0201]

### Nets
GND: C79.2 C80.2 C81.2 C82.1 IC2.A2(RSVD4) IC2.A6(RSVD1) IC2.A7(RSVD2) IC2.B4(THERMALPAD) IC2.C1(GND_2) IC2.C6(RSVD3) IC2.C7(GND_3) R31.1
VCC_1.8V_TOF: C79.1 IC2.A4(IOVDD) R26.2 R27.2 R28.2 R29.2 R30.2
VCC_2.8V_TOF: C80.1 C81.1 C82.2 IC2.B1(AVDD_1) IC2.B7(AVDD_2)
TOF_I2C_GPIO: IC2.C2(RSVD6) R28.1
TOF_I2C_INT: IC2.A3(INT) R26.1
TOF_I2C_LPN: IC2.A5(LPN) R27.1
TOF_I2C_RST: IC2.A1(I2C_RST) IC2.A8(I2C_RST) R31.2
TOF_I2C_SCL: IC2.C4(SCL) R30.1
TOF_I2C_SDA: IC2.C3(SDA) R29.1

Not connected (* = marked no-connect by the designer): IC2 C5(RSVD5)*

### Notes on the sheet
- ~45uA Draw in Power Down
- ToF
- ~0.1uA Draw in Power Down
- ~45mA Draw Active
- ~50mA Draw Active
- (near IC2) unused

### Library data of the parts
C79-C81 = C-EUC0201: as C54 on sheet usb; DeviceName: C0201; LibraryName: rcl; DeviceSetName: C-EU; SPICEPREFIX: C; Part Number: GRM033R60J224ME15D
C82 = CAP_0402: as C78 on sheet imu; LibraryName: 0402; DeviceSetName: CAP_0402
IC2 = VL53L5CXV0GC_1: Integrated Circuit; Manufacturer_Name: STMicroelectronics; Manufacturer_Part_Number: VL53L5CXV0GC/1; Datasheet Link: https://www.arrow.com/en/products/vl53l5cxv0gc1/stmicroelectronics?region=nac; Height: 1.55mm; Mouser Part Number: 511-VL53L5CXV0GC/1; Mouser Price/Stock: https://www.mouser.co.uk/ProductDetail/STMicroelectronics/VL53L5CXV0GC-1?qs=QNEnbhJQKvZPmRJw6ASPyw%3D%3D; Arrow Part Number: VL53L5CXV0GC/1; Arrow Price/Stock: https://www.arrow.com/en/products/vl53l5cxv0gc1/stmicroelectronics?region=nac; Part Number: VL53L5CXV0GC/1; MPN: VL53L5CXV0GC/1
R26-R28 R31 = RESISTOR0402-RES: MPN: RMCF0201FT47K0; GateName_1: G$1; SymbolName_1: RESISTOR; LibraryName: sfe; DeviceSetName: RESISTOR; Part Number: RMCF0201FT47K0
R29 R30 = RESISTOR0402-RES: MPN: RC0201JR-072K7L; GateName_1: G$1; SymbolName_1: RESISTOR; LibraryName: sfe; DeviceSetName: RESISTOR; Part Number: RC0201JR-072K7L

## Sheet mic.SchDoc
size A
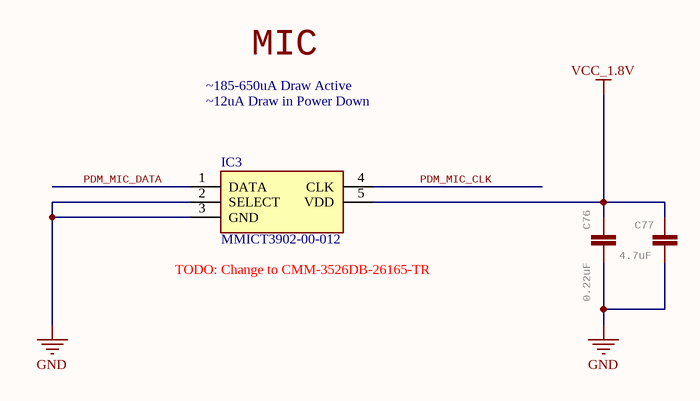
[diagram p6: mic.SchDoc]

### Parts
C76  0.22uF  [C0201]
C77  4.7uF  [0402-CAP]
IC3  MMICT3902-00-012  [MMICT390200012]

### Nets
GND: C76.2 C77.1 IC3.2(SELECT) IC3.3(GND)
VCC_1.8V: C76.1 C77.2 IC3.5(VDD)
PDM_MIC_CLK: IC3.4(CLK)
PDM_MIC_DATA: IC3.1(DATA)

### Notes on the sheet
- ~12uA Draw in Power Down
- ~185-650uA Draw Active
- MIC
- (near IC3) TODO: Change to CMM-3526DB-26165-TR

### Library data of the parts
C76 = C-EUC0201: as C54 on sheet usb; DeviceName: C0201; LibraryName: rcl; DeviceSetName: C-EU; SPICEPREFIX: C; Part Number: GRM033R60J224ME15D
C77 = CAP0402-CAP: as C55 on sheet usb; DeviceName: 0402-CAP; LibraryName: sfe; DeviceSetName: CAP; Part Number: JMK105BBJ475MV-F
IC3 = MMICT3902-00-012: Integrated Circuit; Manufacturer_Name: TDK; Datasheet Link: http://invensense.tdk.com/wp-content/uploads/2020/05/DS-000357-T3902-v1.0.pdf; Height: 1.13mm; Manufacturer_Part_Number: MMICT3902-00-012; Mouser Part Number: 410-MMICT3902-00-012; Mouser Price/Stock: https://www.mouser.co.uk/ProductDetail/TDK-InvenSense/MMICT3902-00-012?qs=yqaQSyyJnNi1lpqXyrpxOA%3D%3D; Arrow Part Number: MMICT3902-00-012; Arrow Price/Stock: https://www.arrow.com/en/products/mmict3902-00-012/invensense?region=nac; Part Number: MMICT3902-00-012; MPN: MMICT3902-00-012

## Sheet regulators.SchDoc
size B
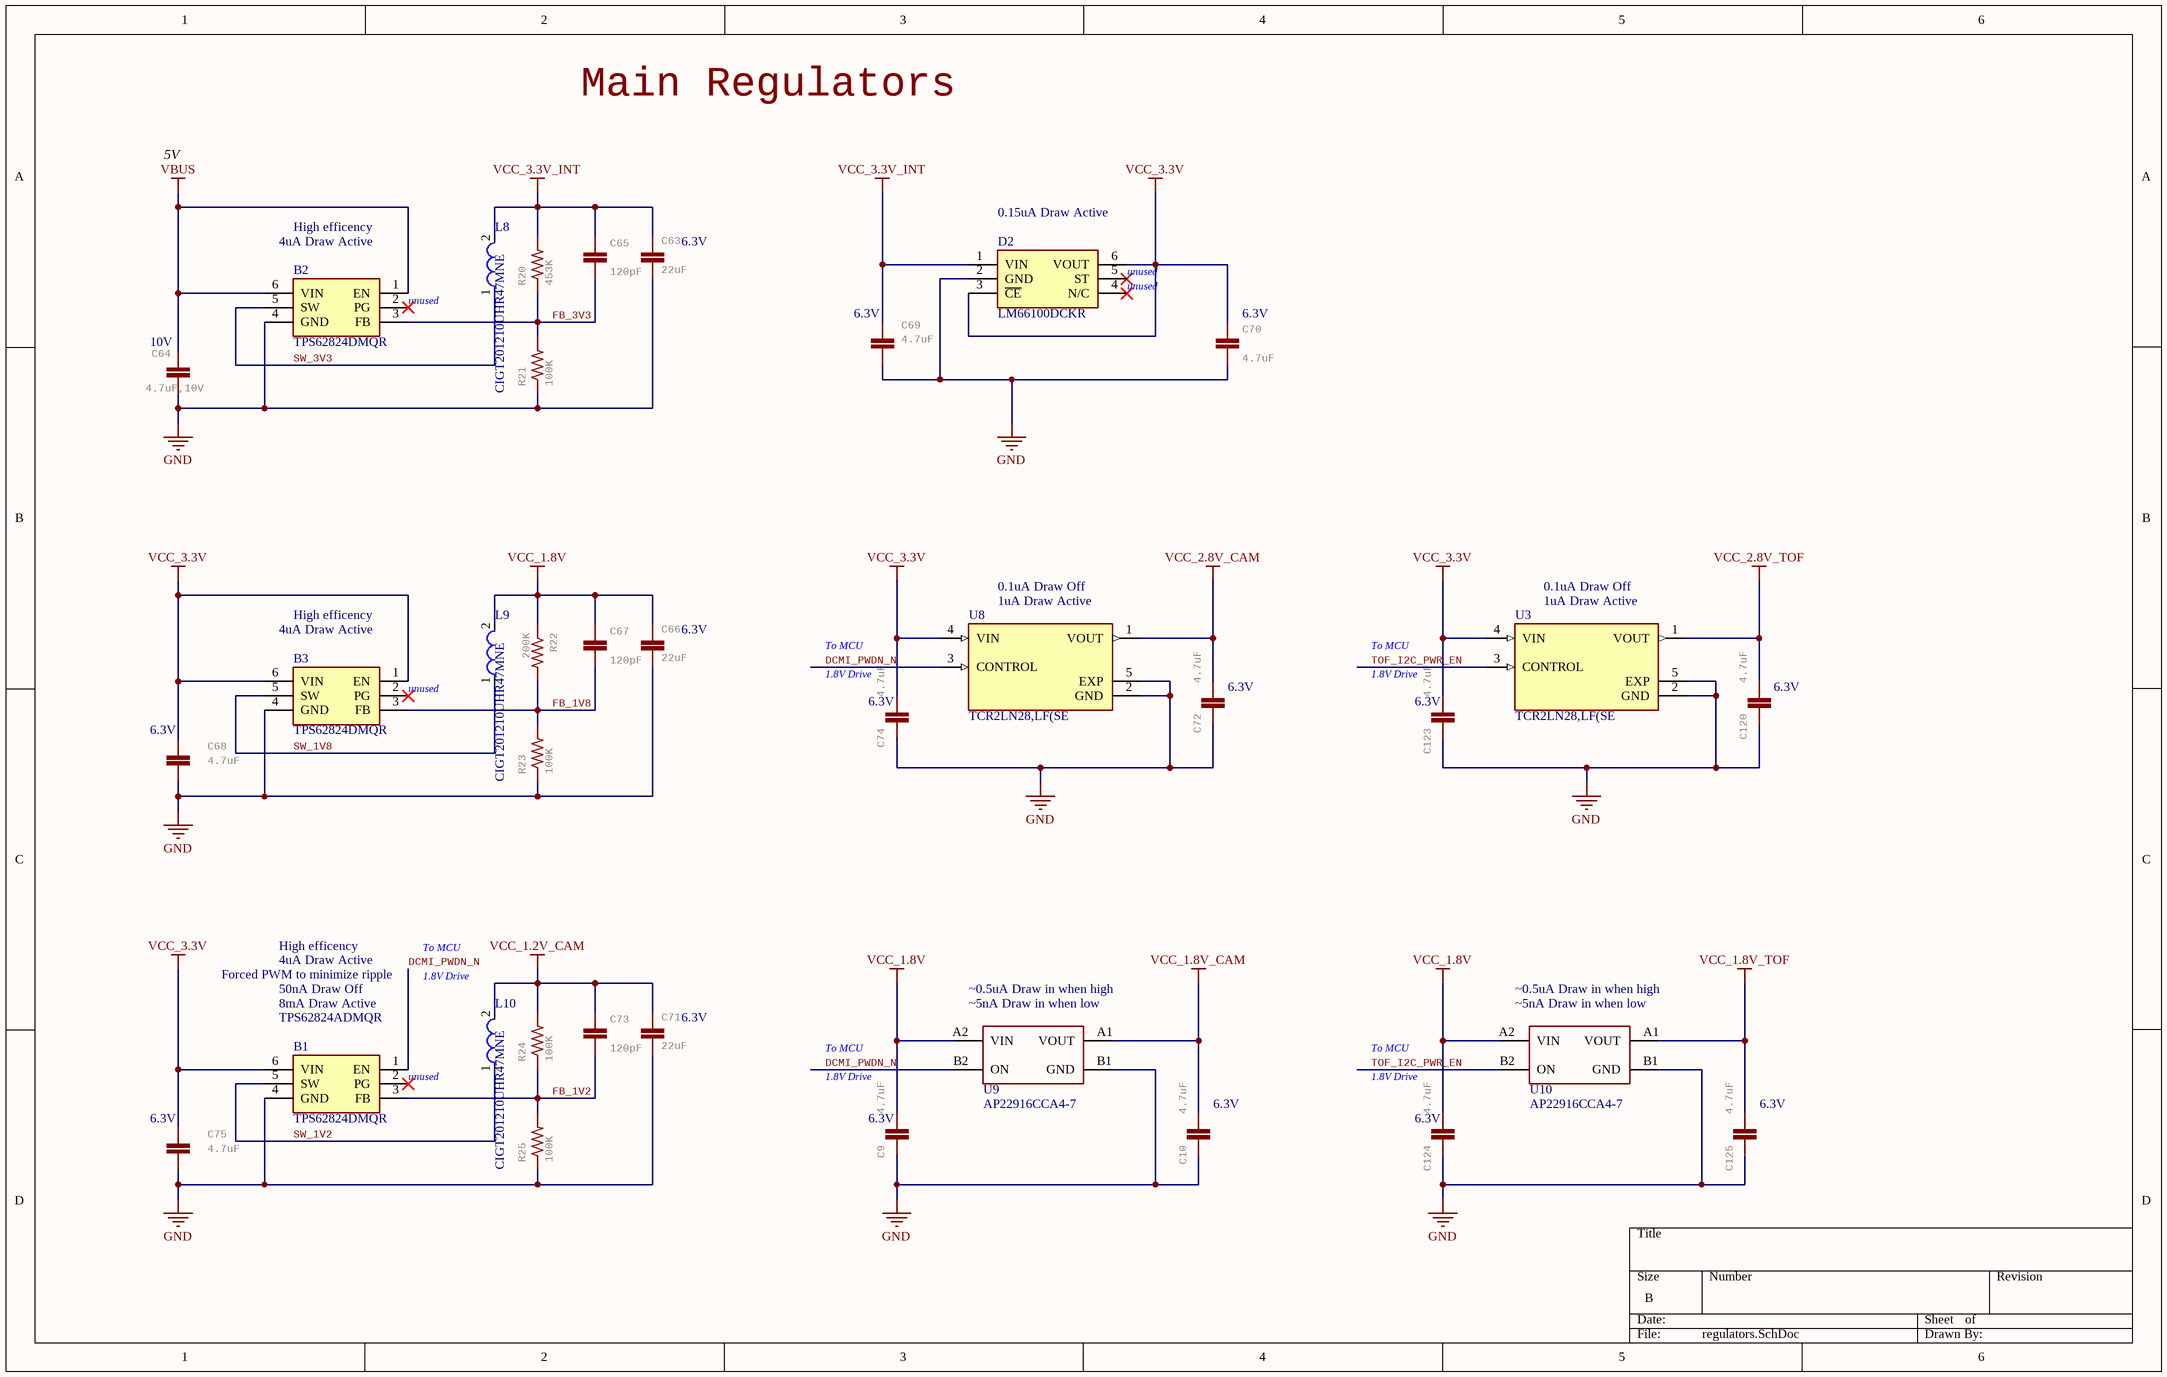
[diagram p7: regulators.SchDoc]

### Parts
B1  TPS62824DMQR  [TPS62826ADMQR]
B2  TPS62824DMQR  [TPS62826ADMQR]
B3  TPS62824DMQR  [TPS62826ADMQR]
C9  4.7uF  [0402-CAP]
C10  4.7uF  [0402-CAP]
C63  22uF  [0805]
C64  4.7uF,10V  [0402-CAP]
C65  120pF  [C0201]
C66  22uF  [0805]
C67  120pF  [C0201]
C68  4.7uF  [0402-CAP]
C69  4.7uF  [0402-CAP]
C70  4.7uF  [0402-CAP]
C71  22uF  [0805]
C72  4.7uF  [0402-CAP]
C73  120pF  [C0201]
C74  4.7uF  [0402-CAP]
C75  4.7uF  [0402-CAP]
C120  4.7uF  [0402-CAP]
C123  4.7uF  [0402-CAP]
C124  4.7uF  [0402-CAP]
C125  4.7uF  [0402-CAP]
D2  LM66100DCKR  [SOP65P210X110-6N]
L8  CIGT201210UHR47MNE  [0805]
L9  CIGT201210UHR47MNE  [0805]
L10  CIGT201210UHR47MNE  [0805]
R20  453K  [R0201]
R21  100K  [R0201]
R22  200K  [R0201]
R23  100K  [R0201]
R24  100K  [R0201]
R25  100K  [R0201]
U3  TCR2LN28,LF(SE  [VREG_TCR2LN30_LF]
U8  TCR2LN28,LF(SE  [VREG_TCR2LN30_LF]
U9  PMOS Load Switch  [AP22916CCA4-7]  (value not drawn)
U10  PMOS Load Switch  [AP22916CCA4-7]  (value not drawn)

### Nets
GND: B1.4(GND) B2.4(GND) B3.4(GND) C9.1 C10.1 C63.2 C64.2 C66.2 C68.1 C69.1 C70.1 C71.2 C72.1 C74.1 C75.1 C120.1 C123.1 C124.1 C125.1 D2.2(GND) R21.1 R23.1 R25.1 U3.2(GND) U3.5(EXP) U8.2(GND) U8.5(EXP) U9.B1(GND) U10.B1(GND)
VBUS: B2.1(EN) B2.6(VIN) C64.1
VCC_1.2V_CAM: C71.1 C73.2 L10.2 R24.2
VCC_1.8V: C9.2 C66.1 C67.2 C124.2 L9.2 R22.1 U9.A2(VIN) U10.A2(VIN)
VCC_1.8V_CAM: C10.2 U9.A1(VOUT)
VCC_1.8V_TOF: C125.2 U10.A1(VOUT)
VCC_2.8V_CAM: C72.2 U8.1(VOUT)
VCC_2.8V_TOF: C120.2 U3.1(VOUT)
VCC_3.3V: B1.6(VIN) B3.1(EN) B3.6(VIN) C68.2 C70.2 C74.2 C75.2 C123.2 D2.3(~{CE}) D2.6(VOUT) U3.4(VIN) U8.4(VIN)
VCC_3.3V_INT: C63.1 C65.2 C69.2 D2.1(VIN) L8.2 R20.2
DCMI_PWDN_N: B1.1(EN) U8.3(CONTROL) U9.B2(ON)
FB_1V2: B1.3(FB) C73.1 R24.1 R25.2
FB_1V8: B3.3(FB) C67.1 R22.2 R23.2
FB_3V3: B2.3(FB) C65.1 R20.1 R21.2
SW_1V2: B1.5(SW) L10.1
SW_1V8: B3.5(SW) L9.1
SW_3V3: B2.5(SW) L8.1
TOF_I2C_PWR_EN: U3.3(CONTROL) U10.B2(ON)

Not connected (* = marked no-connect by the designer): B1 2(PG)*; B2 2(PG)*; B3 2(PG)*; D2 4(N/C)* 5(ST)*

### Notes on the sheet
- Main Regulators
- 5V
- (near B2) 4uA Draw Active
- High efficency
- (near C63) 6.3V
- (near D2) 0.15uA Draw Active
- (near B2) unused
- (near C69) 6.3V
- (near D2) unused
- (near C70) 6.3V
- (near C64) 10V
- (near U8) 1uA Draw Active
- (near U8) 0.1uA Draw Off
- (near U3) 1uA Draw Active
- (near U3) 0.1uA Draw Off
- (near B3) 4uA Draw Active
- (near C66) 6.3V
- To MCU
- (near C74) 1.8V Drive
- (near C123) 1.8V Drive
- (near C68) 6.3V
- (near B3) unused
- (near C74) 6.3V
- (near C72) 6.3V
- (near C123) 6.3V
- (near C120) 6.3V
- 4uA Draw Active
- Forced PWM to minimize ripple
- 8mA Draw Active
- 50nA Draw Off
- (near B1) TPS62824ADMQR
- (near L10) 1.8V Drive
- (near C71) 6.3V
- (near U9) ~5nA Draw in when low
- (near U9) ~0.5uA Draw in when high
- (near U10) ~5nA Draw in when low
- (near U10) ~0.5uA Draw in when high
- (near B1) unused
- (near C9) 1.8V Drive
- (near C10) 6.3V
- (near C124) 1.8V Drive
- (near C125) 6.3V
- (near C75) 6.3V
- (near C9) 6.3V
- (near C124) 6.3V

### Library data of the parts
B1 B3 = TPS62826ADMQR: Switching Voltage Regulators 2.4-V to 5.5-V input, 1-A step-down converter in 1.5-mm 1.5-mm QFN package; Manufacturer_Name: Texas Instruments; Geometry.Height: 1mm; Mouser Part Number: 595-TPS62824DMQR; Mouser Price/Stock: https://www.mouser.co.uk/ProductDetail/Texas-Instruments/TPS62826ADMQR?qs=KUoIvG%2F9Ila3pPUbedlDEw%3D%3D; Manufacturer_Part_Number: TPS62824DMQR; Datasheet Link: https://www.ti.com/lit/ds/symlink/tps62825a.pdf?ts=1608196934558&ref_url=https%253A%252F%252Fwww.ti.com%252Fstore%252Fti%252Fen%252Fp%252Fproduct%252F%253Fp%253DTPS62825ADMQR%2526keyMatch%253DTPS62825ADMQR%2526tisearch%253DSearch-EN-everything%2526usecase; MPN: TPS62824DMQR; Part Number: TPS62824DMQR
B2 = TPS62826ADMQR: Switching Voltage Regulators 2.4-V to 5.5-V input, 3-A step-down converter with in 1.5-mm 1.5-mm QFN package; Manufacturer_Name: Texas Instruments; Manufacturer_Part_Number: TPS62826DMQR; Geometry.Height: 1mm; Mouser Part Number: 595-TPS62826DMQR; Mouser Price/Stock: https://www.mouser.co.uk/ProductDetail/Texas-Instruments/TPS62826ADMQR?qs=KUoIvG%2F9Ila3pPUbedlDEw%3D%3D; Datasheet Link: https://www.ti.com/lit/ds/symlink/tps62825a.pdf?ts=1608196934558&ref_url=https%253A%252F%252Fwww.ti.com%252Fstore%252Fti%252Fen%252Fp%252Fproduct%252F%253Fp%253DTPS62825ADMQR%2526keyMatch%253DTPS62825ADMQR%2526tisearch%253DSearch-EN-everything%2526usecase; MPN: TPS62824DMQR; Part Number: TPS62824DMQR
C9 C10 C72 C74 C120 C123-C125 = CAP_0402: as C78 on sheet imu; LibraryName: 0402; DeviceSetName: CAP_0402
C63 C66 C71 = 22UF-0805-6.3V-20%: as C2 on sheet flash; DeviceName: -0805-6.3V-20%; LibraryName: SparkFun-Capacitors; DeviceSetName: 22UF; Part Number: CL21A226MQQNNNE
C64 = CAP0402-CAP: CapacitorStandard 0603 ceramic capacitor, and 0.1" leaded capacitor.; MPN: CL05A475MP5NRNC; GateName_1: G$1; SymbolName_1: CAP; DeviceName: 0402-CAP; LibraryName: sfe; DeviceSetName: CAP; Part Number: CL05A475MP5NRNC
C65 C67 C73 = CAP0402-CAP: MPN: GRM033R71H121KA12D; GateName_1: G$1; SymbolName_1: CAP; LibraryName: sfe; DeviceSetName: CAP; Part Number: GRM033R71H121KA12D
C68-C70 C75 = CAP0402-CAP: as C55 on sheet usb; DeviceName: 0402-CAP; LibraryName: sfe; DeviceSetName: CAP; Part Number: JMK105BBJ475MV-F
D2 = LM66100DCKR: Diode; Manufacturer_Name: Texas Instruments; Manufacturer_Part_Number: c; Datasheet Link: http://www.ti.com/lit/gpn/LM66100; Height: 1.1mm; Mouser Part Number: 595-LM66100DCKR; Mouser Price/Stock: https://www.mouser.co.uk/ProductDetail/Texas-Instruments/LM66100DCKR?qs=vLWxofP3U2y2yPPrXoBBoA%3D%3D; Arrow Part Number: LM66100DCKR; Arrow Price/Stock: null?region=nac; MPN: LM66100DCKR; Part Number: LM66100DCKR
L8-L10 = CMP-00002-1: Power Inductor : LxW size(mm) 2012 Thickness1 Inductance (uH) 20%: 0.47; Current Rating: 3.6A; Shielding: Unshielded; Test Frequency: 1MHz; DC Resistance (DCR): 31mR; Saturation Current: 5.4A; Core Material: Metal,Composite; Value: 470nH; Tolerance: 20%; Packaging: Cut Tape; Case Code (Imperial): 0805; Case/Package: 0805; RoHS Compliant: Yes; Max Operating Temperature: 125°C; Series: CIGT; Min Operating Temperature: -40°C; Mounting Technology: Surface Mount; Case Code (Metric): 2012; MPN: CIGT201210UHR47MNE; Part Number: CIGT201210UHR47MNE
R20 = RESISTOR0402-RES: MPN: ERJ-1GNF4533C; GateName_1: G$1; SymbolName_1: RESISTOR; LibraryName: sfe; DeviceSetName: RESISTOR; Part Number: ERJ-1GNF4533C
R21 R23-R25 = RESISTOR0402-RES: MPN: RMCF0201FT100K; GateName_1: G$1; SymbolName_1: RESISTOR; LibraryName: sfe; DeviceSetName: RESISTOR; Part Number: RMCF0201FT100K
R22 = RESISTOR0402-RES: MPN: RC0201JR-07200KL; GateName_1: G$1; SymbolName_1: RESISTOR; LibraryName: sfe; DeviceSetName: RESISTOR; Part Number: RC0201JR-07200KL
U3 U8 = CMP-079-000000-1: Linear Voltage Regulator IC Positive Fixed 1 Output 200mA 4-SDFN (0.8x0.8); MF: Toshiba Semiconductor; Component Type: Standard; Availability: In Stock; Value: *; Price: None; Design Item ID: TCR2LN28,LF(SE; MP: TCR2LN28,LF(SE; Package: XFDFN-4 Toshiba; Source: TCR2LN30_LF.SchLib; Pin Count: 5; MPN: TCR2LN28,LF(SE; Part Number: TCR2LN28,LF(SE
U9 U10 = AP22916CCA4-7: MF: Diodes Inc; MPN: AP22916CCA4-7; Part Number: AP22916CCA4-7

## Sheet b2b.SchDoc
size A
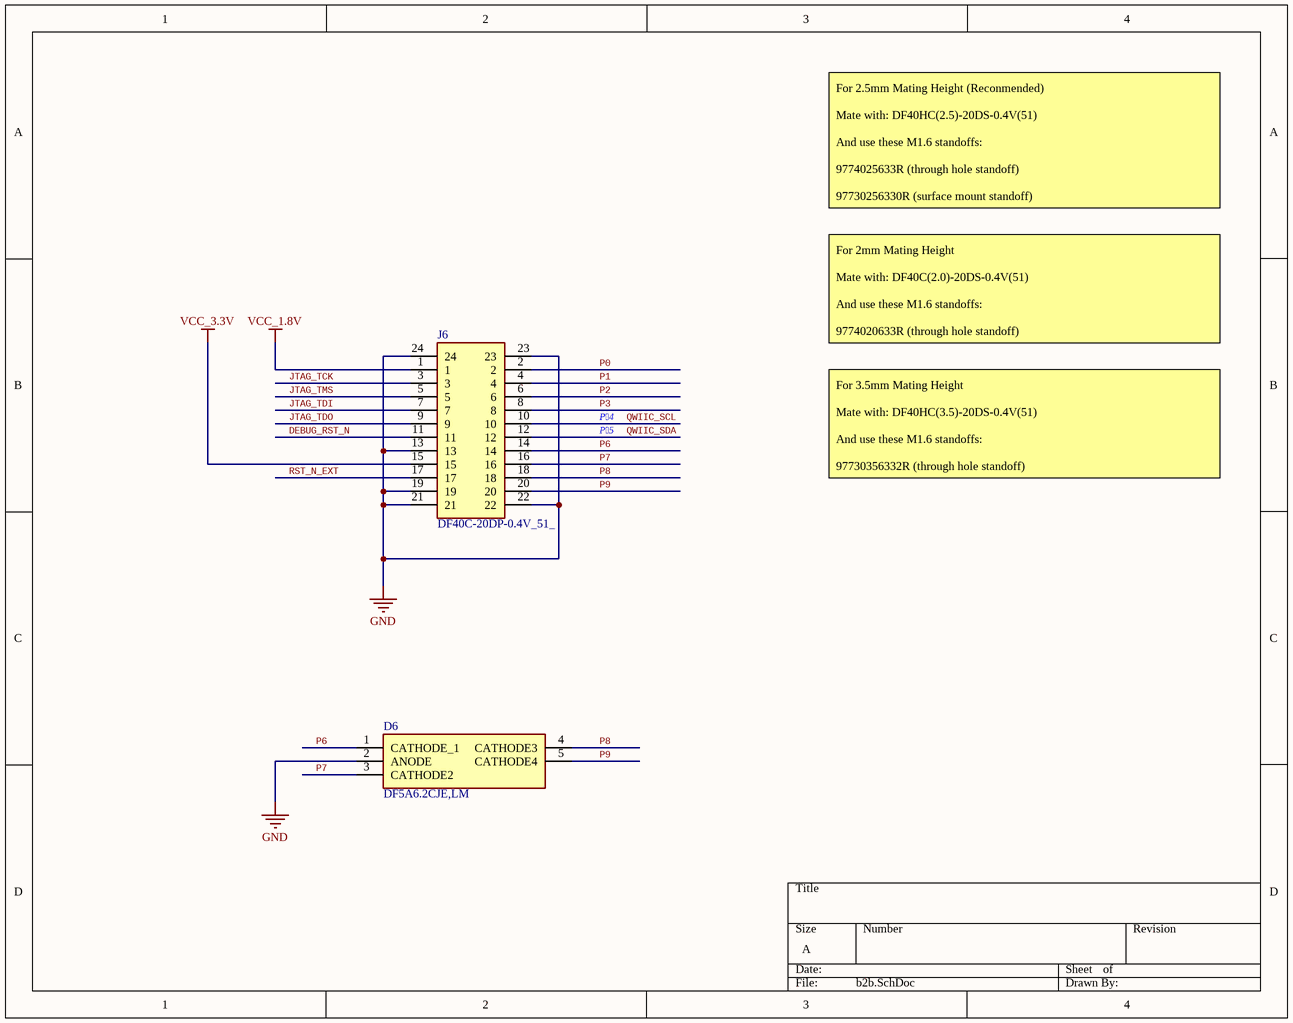
[diagram p8: b2b.SchDoc]

### Parts
D6  DF5A6.2CJE,LM  [SOTFL50P160X60-5N]
J6  DF40C-20DP-0.4V_51_  [DF40C20DP04V51]

### Nets
GND: D6.2(ANODE) J6.13 J6.19 J6.21 J6.22 J6.23 J6.24
VCC_1.8V: J6.1
VCC_3.3V: J6.15
DEBUG_RST_N: J6.11
JTAG_TCK: J6.3
JTAG_TDI: J6.7
JTAG_TDO: J6.9
JTAG_TMS: J6.5
P0: J6.2
P1: J6.4
P2: J6.6
P3: J6.8
P6: D6.1(CATHODE_1) J6.14
P7: D6.3(CATHODE2) J6.16
P8: D6.4(CATHODE3) J6.18
P9: D6.5(CATHODE4) J6.20
QWIIC_SCL: J6.10
QWIIC_SDA: J6.12
RST_N_EXT: J6.17

### Notes on the sheet
- For 2.5mm Mating Height (Reconmended)
  Mate with: DF40HC(2.5)-20DS-0.4V(51)
  And use these M1.6 standoffs:
  9774025633R (through hole standoff)
  97730256330R (surface mount standoff)
- For 2mm Mating Height
  Mate with: DF40C(2.0)-20DS-0.4V(51)
  And use these M1.6 standoffs:
  9774020633R (through hole standoff)
- P4
- P5
- For 3.5mm Mating Height
  Mate with: DF40HC(3.5)-20DS-0.4V(51)
  And use these M1.6 standoffs:
  97730356332R (through hole standoff)
  97730356330R (surface mount standoff)

### Library data of the parts
D6 = DF5A5.6CJE,LM: Diode; Manufacturer_Name: Toshiba; Height: 0.6mm; Manufacturer_Part_Number: DF5A6.2CJE,LM; Mouser Part Number: 757-DF5A6.2CJE,LM; Arrow Part Number: DF5A6.2CJE,LM; MPN: DF5A6.2CJE,LM; Part Number: DF5A6.2CJE,LM
J6 = DF40C-20DP-0.4V_51_: Connector; Manufacturer_Name: Hirose; Manufacturer_Part_Number: DF40C-20DP-0.4V(51); Datasheet Link: https://datasheet.datasheetarchive.com/originals/distributors/Datasheets-DGA17/1059795.pdf; Height: 1.29mm; Mouser Part Number: 798-DF40C20DP0.4V51; Mouser Price/Stock: https://www.mouser.co.uk/ProductDetail/Hirose-Connector/DF40C-20DP-0.4V51?qs=eDUdFcBPps31lPFyZ%252BXRFg%3D%3D; Arrow Part Number: DF40C-20DP-0.4V(51); Arrow Price/Stock: https://www.arrow.com/en/products/df40c-20dp-0.4v-51/hirose-electric; MPN: DF40C-20DP-0.4V(51); Part Number: DF40C-20DP-0.4V(51)